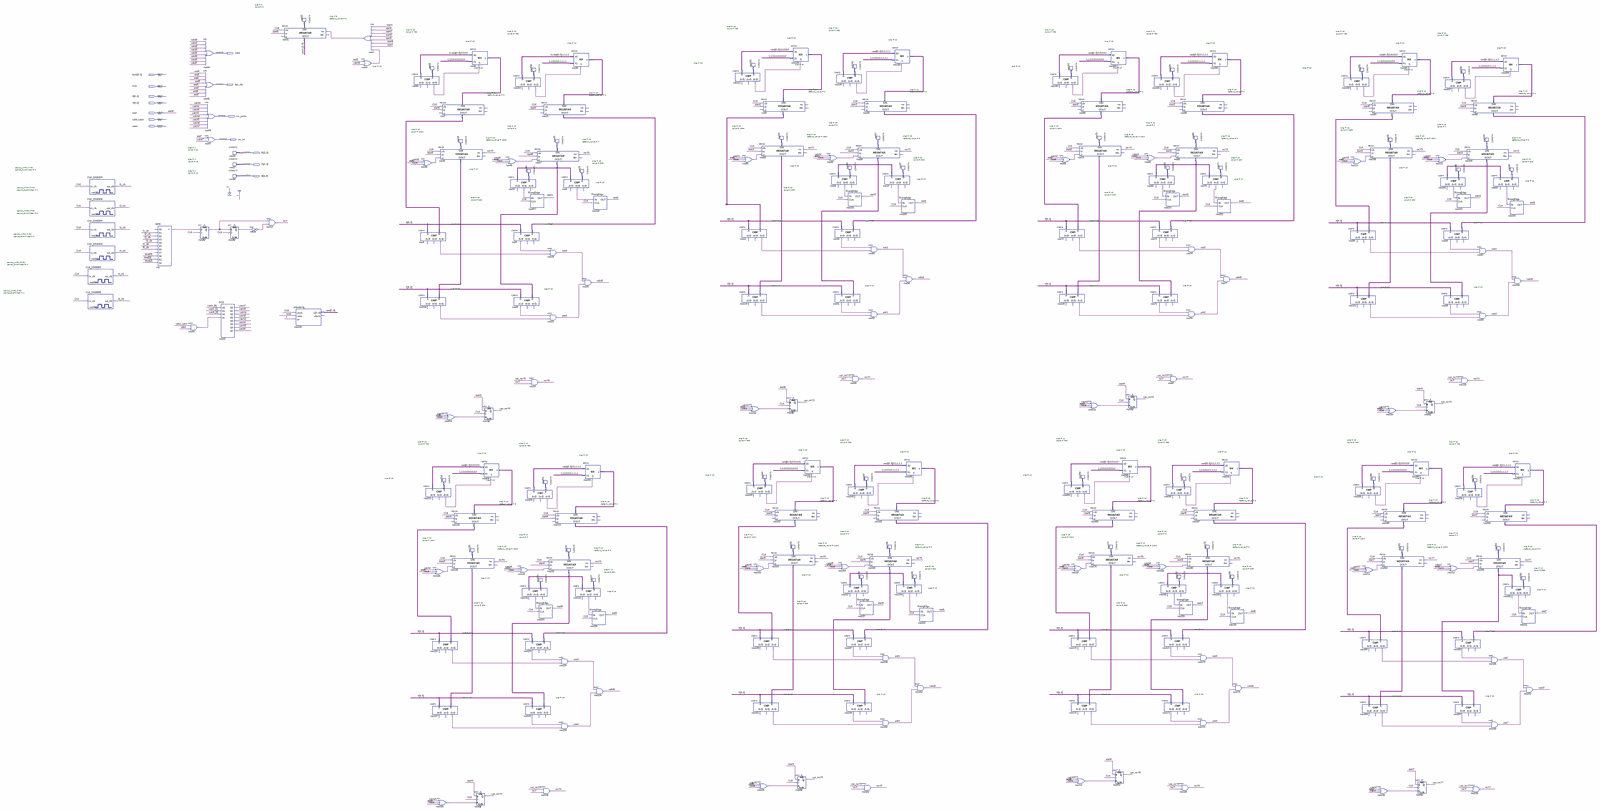
[diagram p0: schematic sheet, whole]
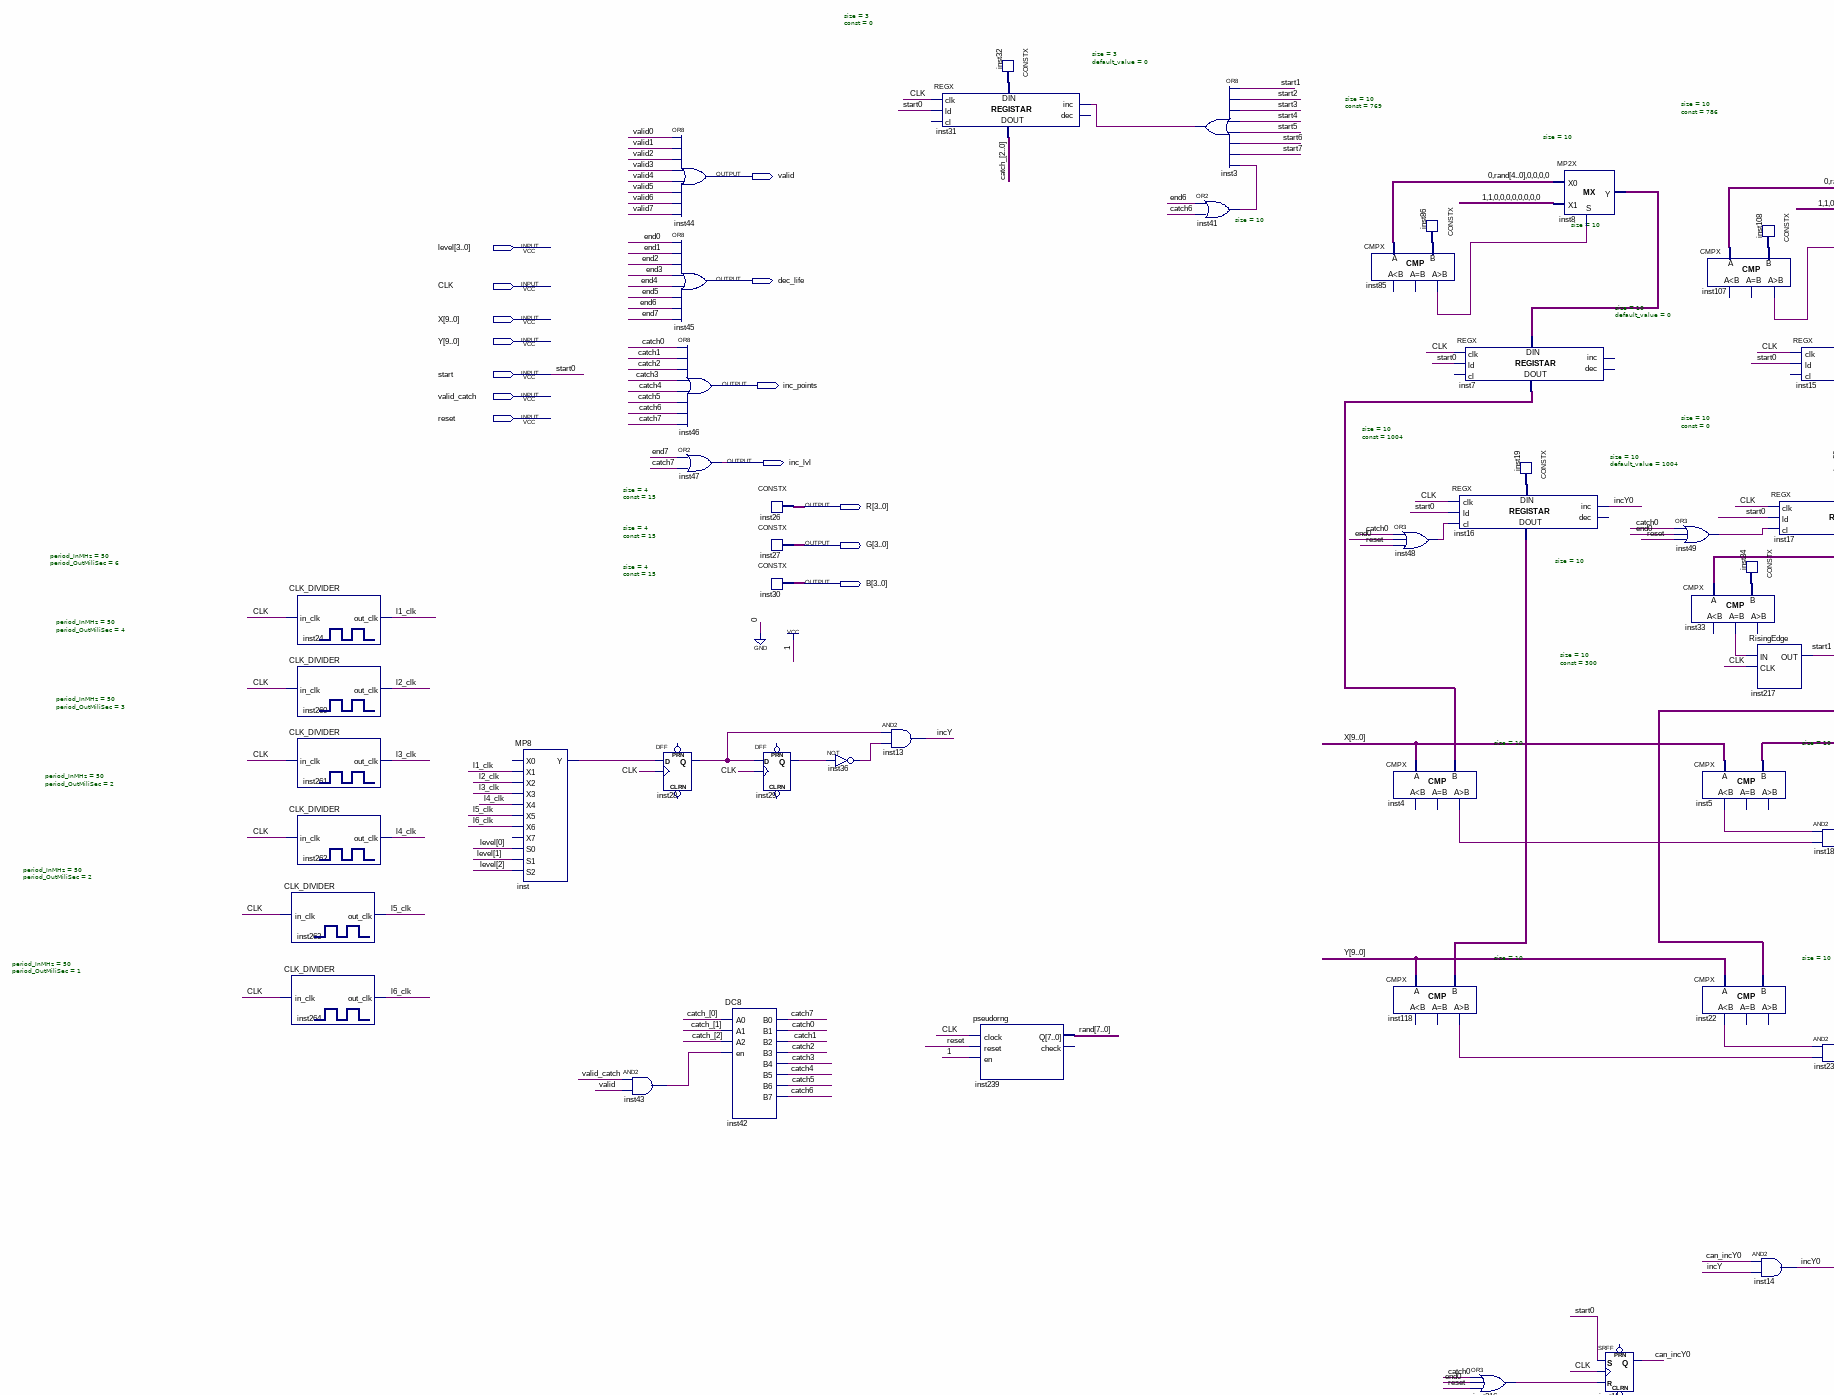
[diagram p1: schematic sheet, upper left part]
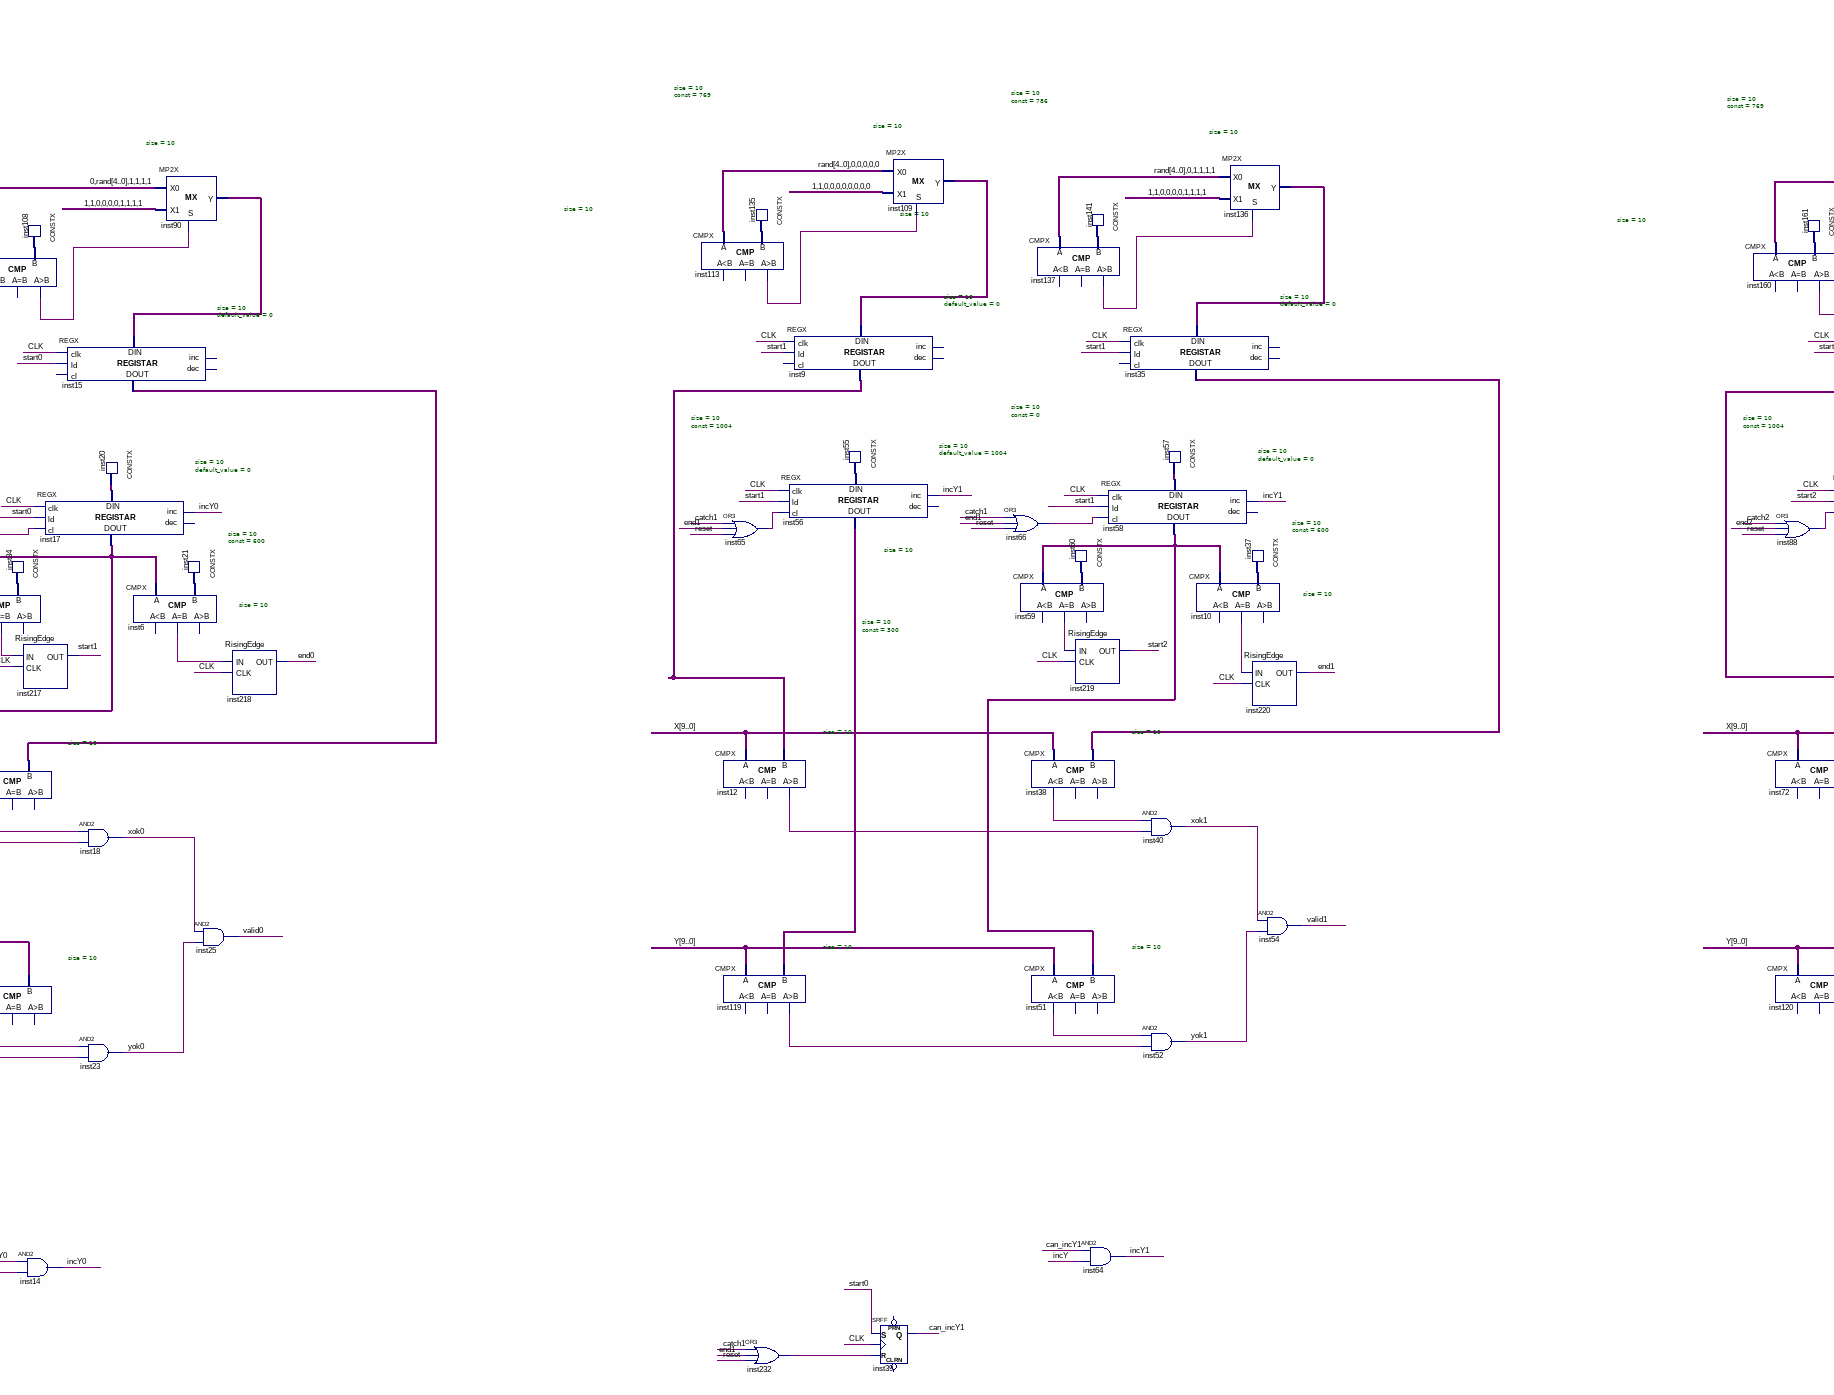
[diagram p2: schematic sheet, upper centre part]
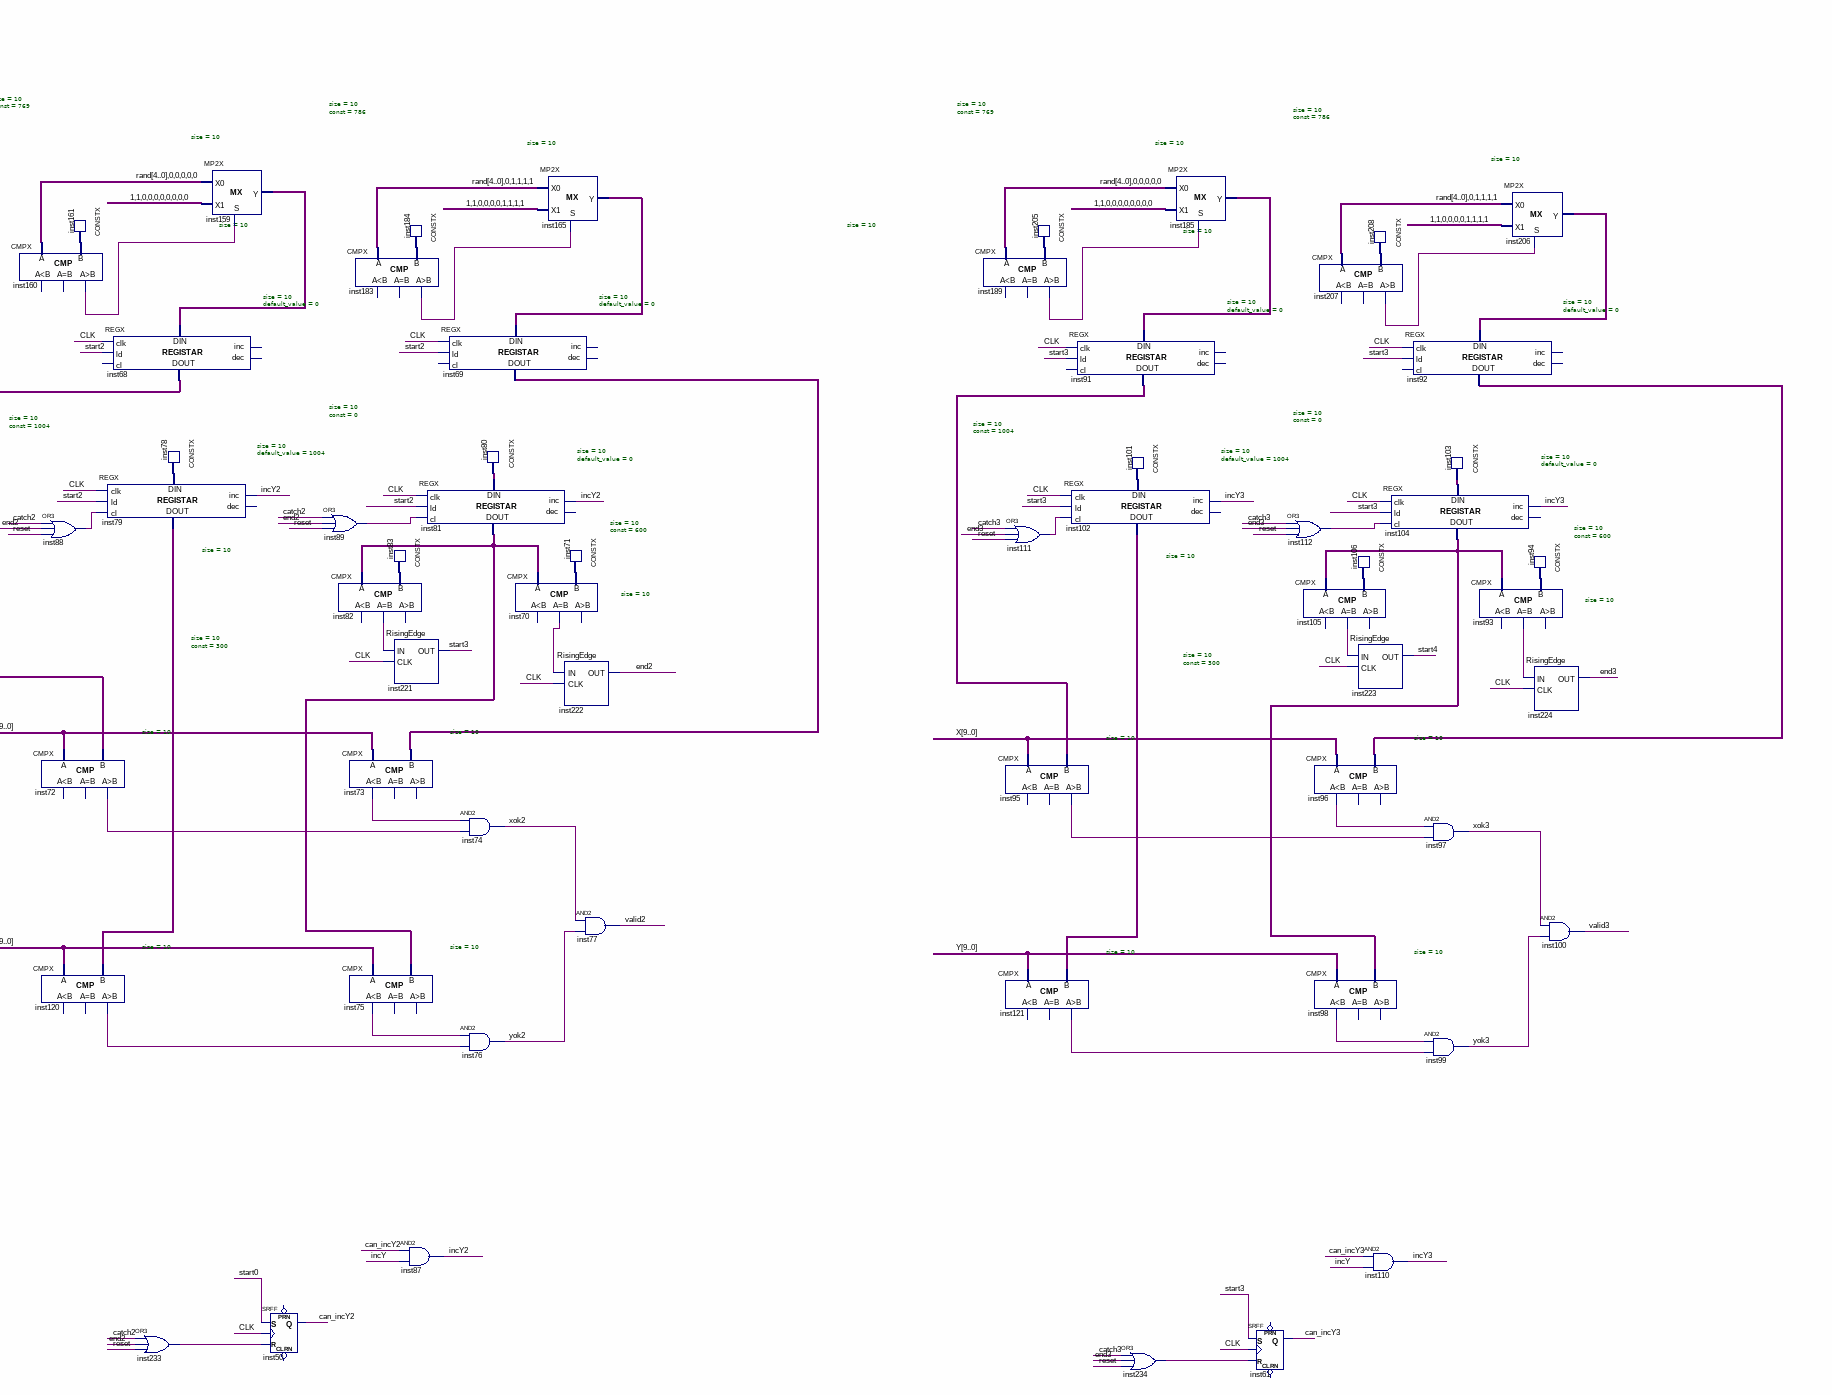
[diagram p3: schematic sheet, upper right part]
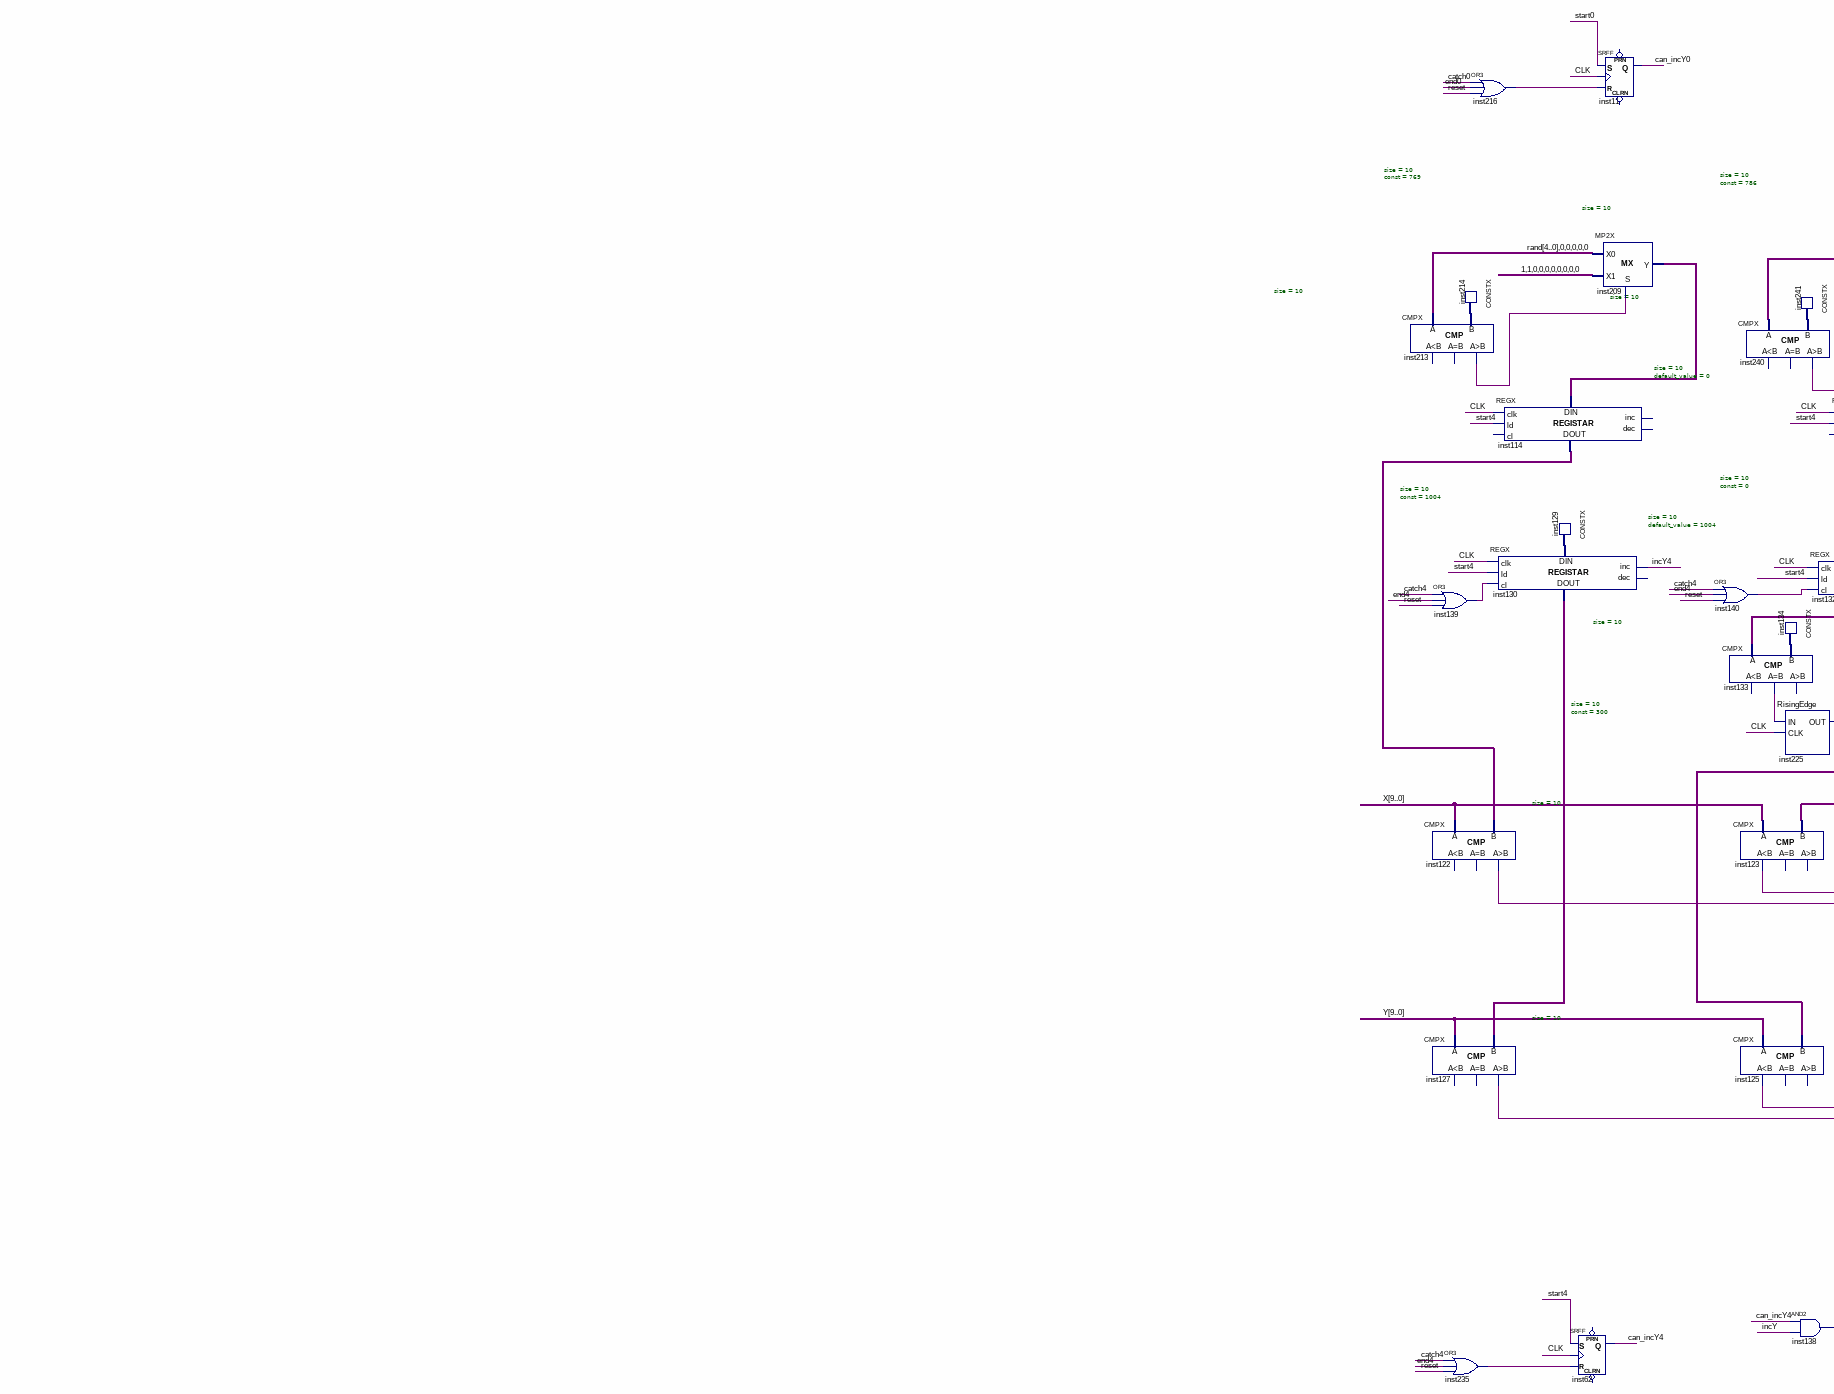
[diagram p4: schematic sheet, lower left part]
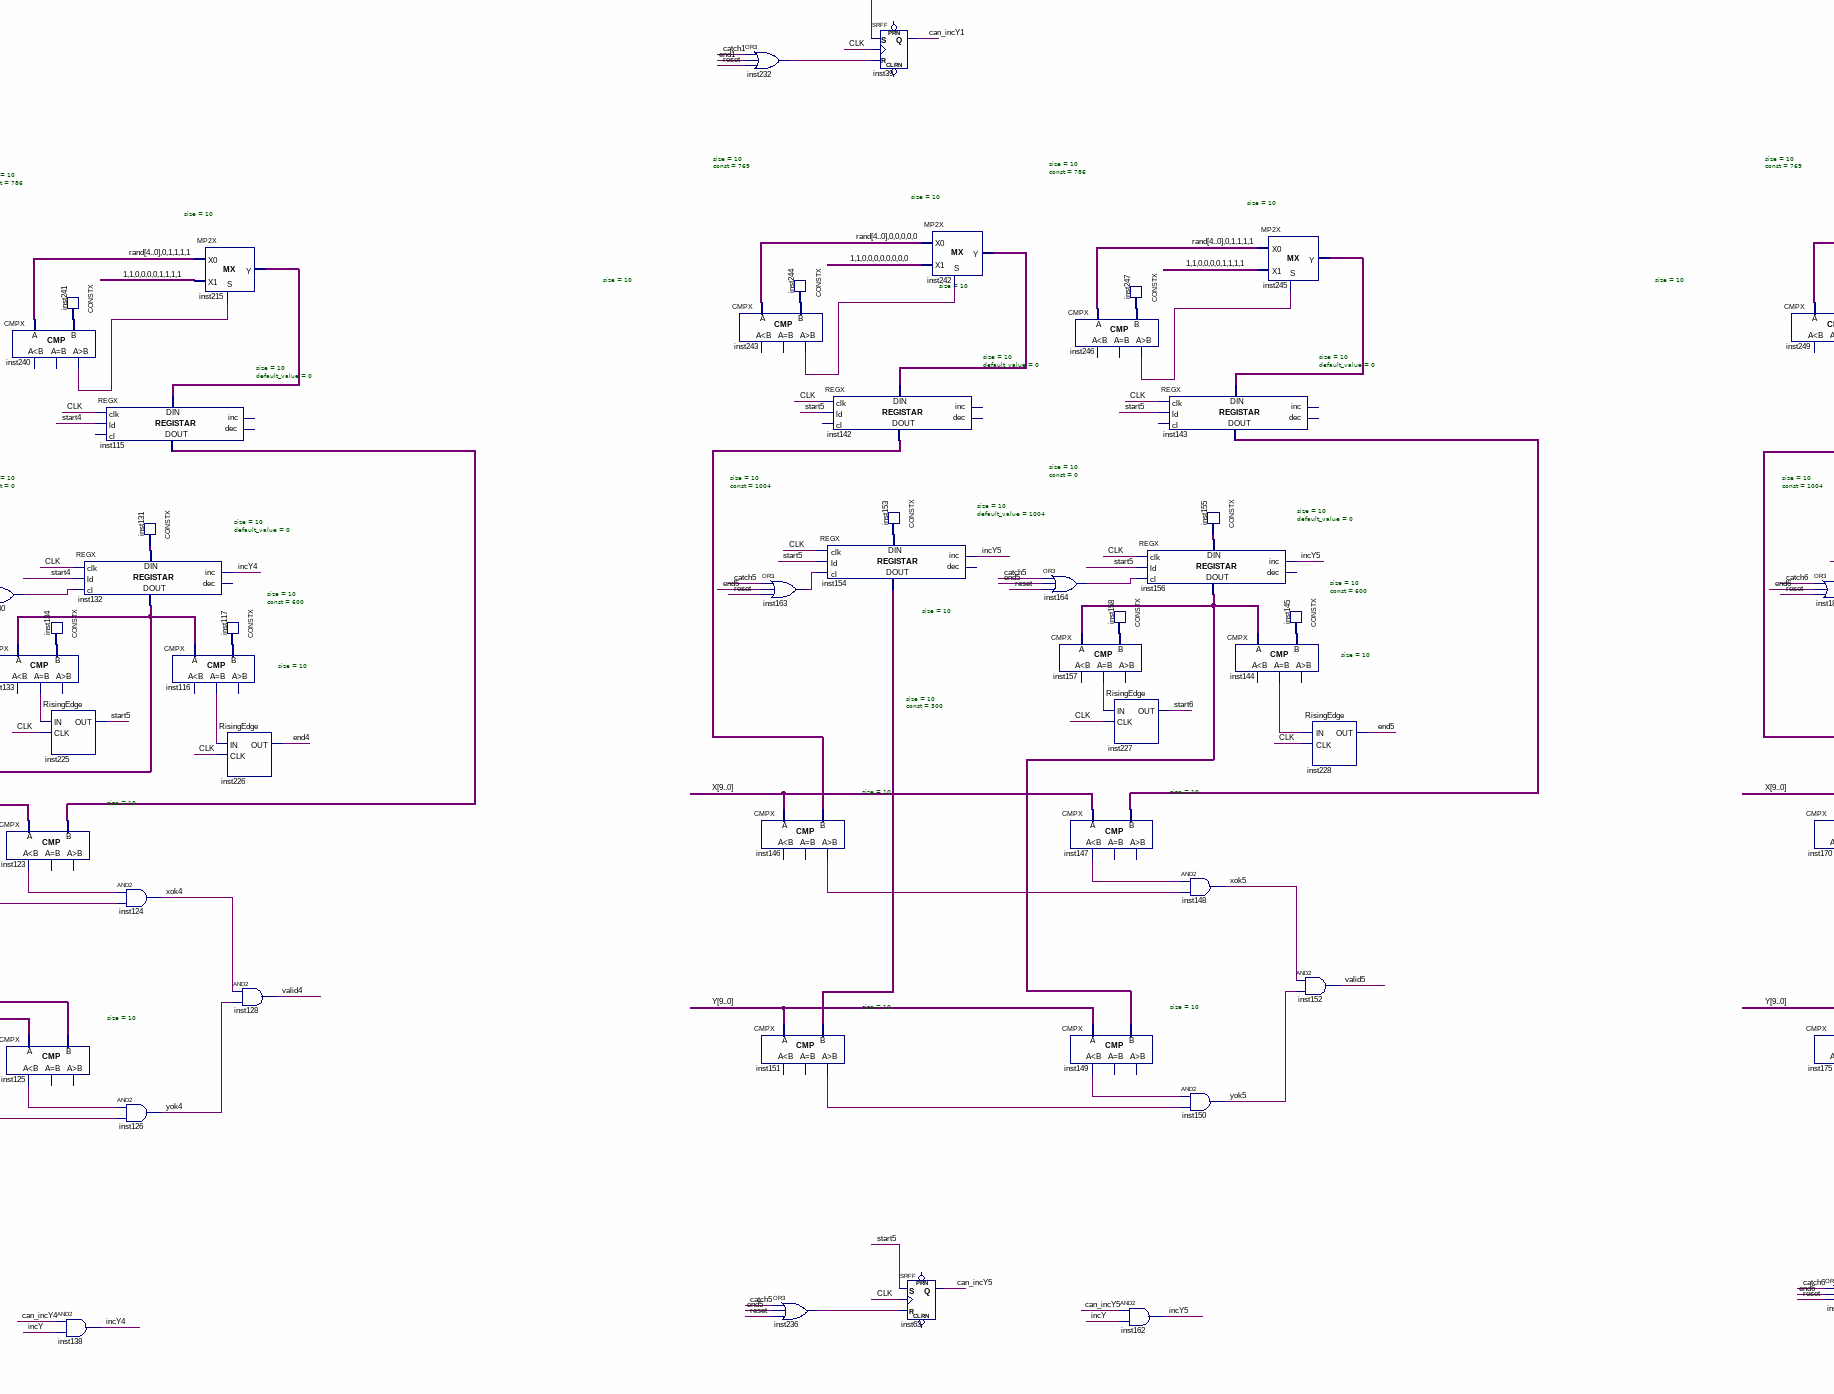
[diagram p5: schematic sheet, lower centre part]
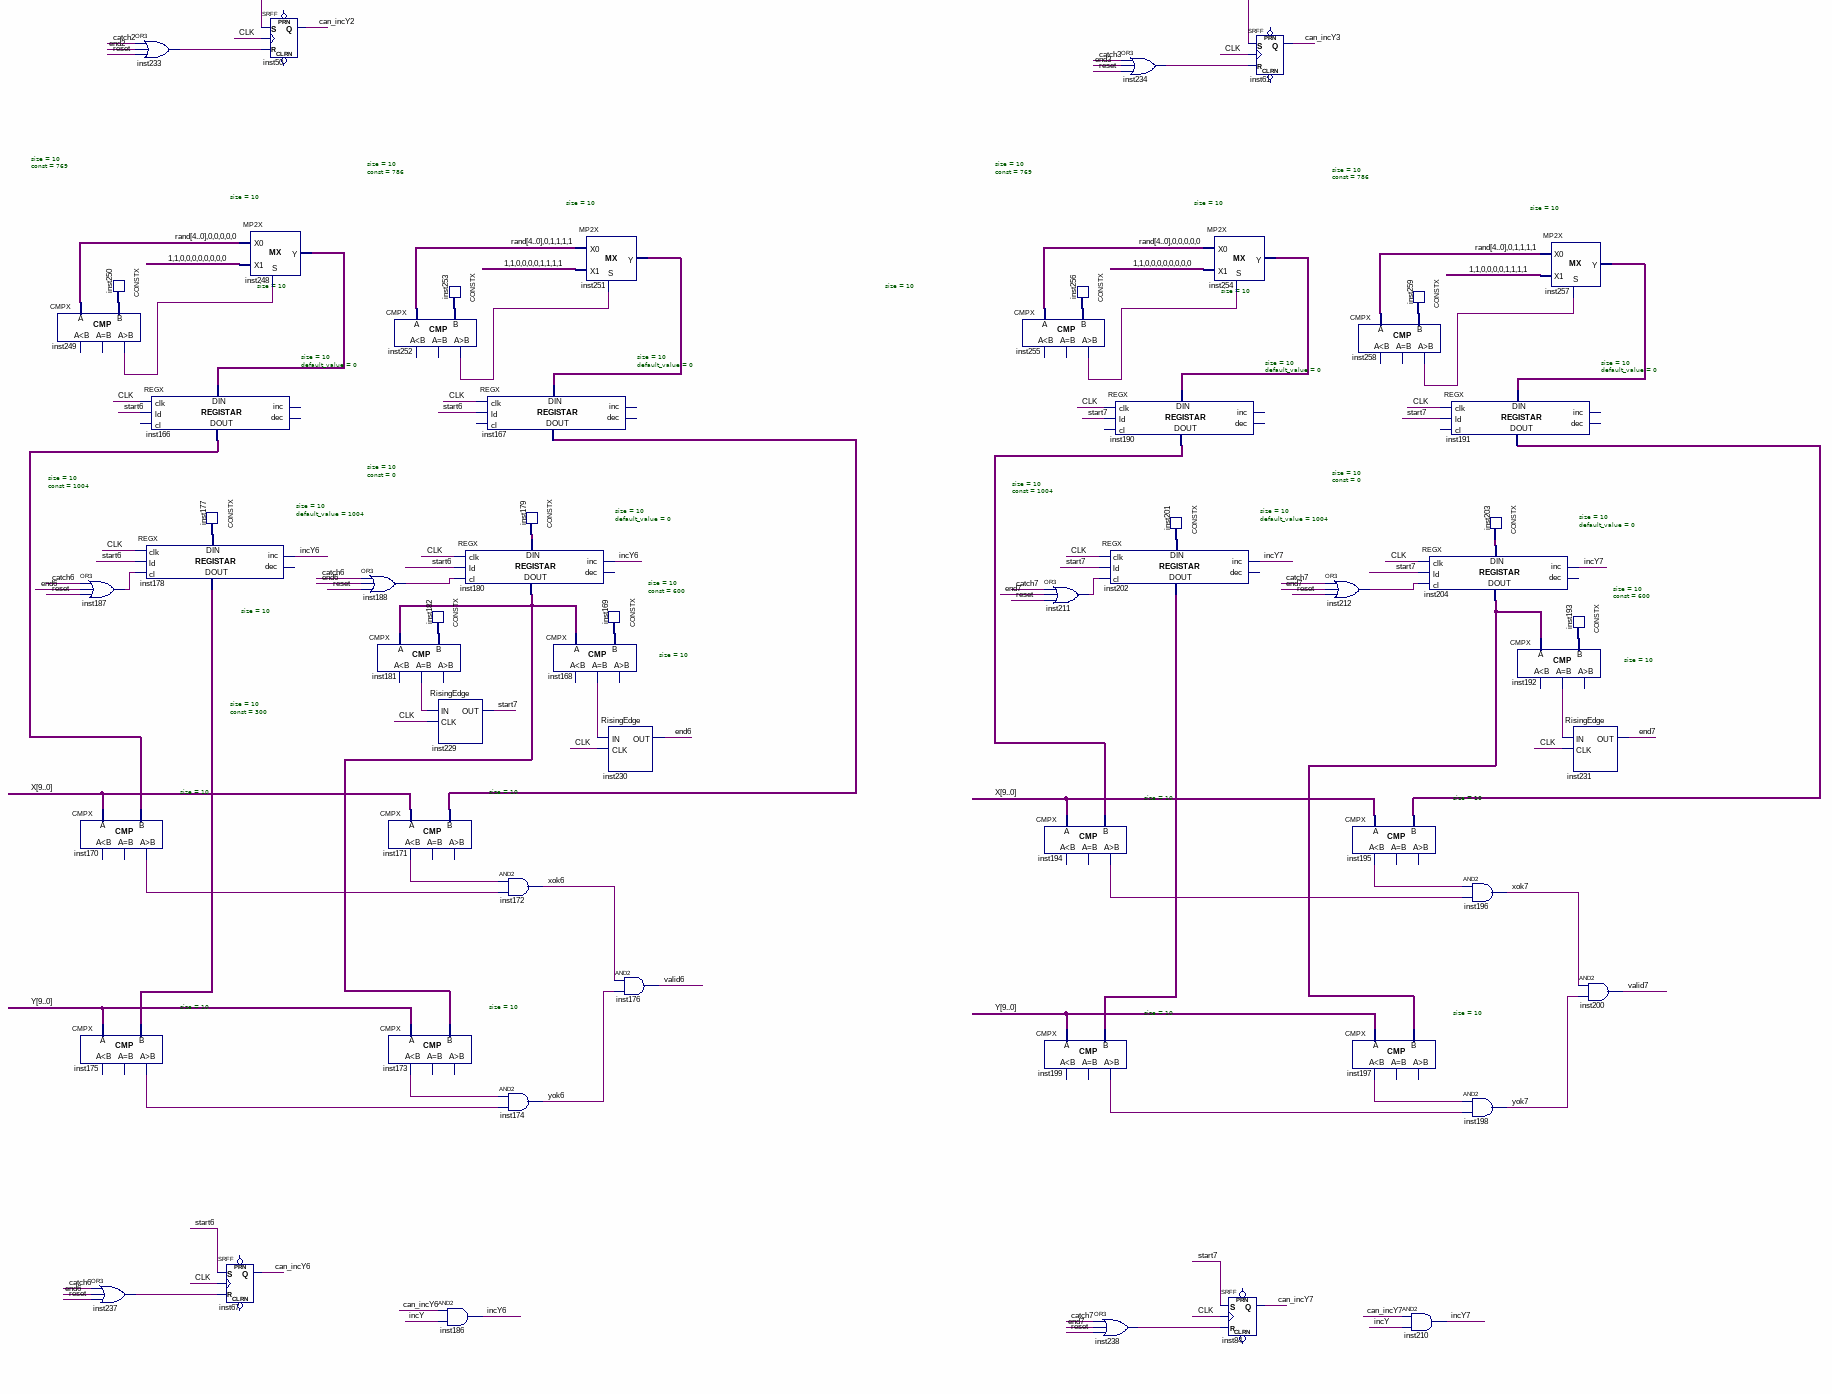
[diagram p6: schematic sheet, lower right part]
// Quartus schematic Layer2.bdf as structural Verilog: 262 symbols, 14 pins
module Layer2 (
  input  [3:0] level,
  input  CLK,
  input  [9:0] X,
  input  [9:0] Y,
  input  start,
  input  valid_catch,
  input  reset,
  output valid,
  output dec_life,
  output inc_points,
  output inc_lvl,
  output [3:0] R,
  output [3:0] G,
  output [3:0] B
);

  wire can_incY0, can_incY1, can_incY2, can_incY3, can_incY4, can_incY5, can_incY6, can_incY7, catch0,
       catch1, catch2, catch3, catch4, catch5, catch6, catch7, end0, end1, end2, end3, end4, end5, end6,
       end7, incY, incY0, incY1, incY2, incY3, incY4, incY5, incY6, incY7, inst3_out, inst4_gr, inst5_ls,
       inst6_eq, inst10_eq, inst12_gr, inst22_ls, inst28_q, inst29_q, inst33_eq, inst36_out, inst38_ls,
       inst41_out, inst43_out, inst48_out, inst49_out, inst51_ls, inst59_eq, inst65_out, inst66_out,
       inst70_eq, inst72_gr, inst73_ls, inst75_ls, inst82_eq, inst85_gr, inst88_out, inst89_out, inst93_eq,
       inst95_gr, inst96_ls, inst98_ls, inst105_eq, inst107_gr, inst111_out, inst112_out, inst113_gr,
       inst116_eq, inst118_gr, inst119_gr, inst120_gr, inst121_gr, inst122_gr, inst123_ls, inst125_ls,
       inst127_gr, inst133_eq, inst137_gr, inst139_out, inst140_out, inst144_eq, inst146_gr, inst147_ls,
       inst149_ls, inst151_gr, inst157_eq, inst160_gr, inst163_out, inst164_out, inst168_eq, inst170_gr,
       inst171_ls, inst173_ls, inst175_gr, inst181_eq, inst183_gr, inst187_out, inst188_out, inst189_gr,
       inst192_eq, inst194_gr, inst195_ls, inst197_ls, inst199_gr, inst207_gr, inst211_out, inst212_out,
       inst213_gr, inst216_out, inst232_out, inst233_out, inst234_out, inst235_out, inst236_out, inst237_out,
       inst238_out, inst240_gr, inst243_gr, inst246_gr, inst249_gr, inst252_gr, inst255_gr, inst258_gr,
       inst_y, l1_clk, l2_clk, l3_clk, l4_clk, l5_clk, l6_clk, start1, start2, start3, start4, start5,
       start6, start7, valid0, valid1, valid2, valid3, valid4, valid5, valid6, valid7, xok0, xok1, xok2,
       xok3, xok4, xok5, xok6, xok7, yok0, yok1, yok2, yok3, yok4, yok5, yok6, yok7;
  wire [2:0] catch_, inst32_data;
  wire [7:0] \rand ;
  wire [9:0] inst7_data_out, inst8_y, inst9_data_out, inst15_data_out, inst16_data_out, inst17_data_out,
       inst19_data, inst20_data, inst21_data, inst34_data, inst35_data_out, inst37_data, inst55_data,
       inst56_data_out, inst57_data, inst58_data_out, inst60_data, inst68_data_out, inst69_data_out,
       inst71_data, inst78_data, inst79_data_out, inst80_data, inst81_data_out, inst83_data, inst86_data,
       inst90_y, inst91_data_out, inst92_data_out, inst94_data, inst101_data, inst102_data_out, inst103_data,
       inst104_data_out, inst106_data, inst108_data, inst109_y, inst114_data_out, inst115_data_out,
       inst117_data, inst129_data, inst130_data_out, inst131_data, inst132_data_out, inst134_data,
       inst135_data, inst136_y, inst141_data, inst142_data_out, inst143_data_out, inst145_data, inst153_data,
       inst154_data_out, inst155_data, inst156_data_out, inst158_data, inst159_y, inst161_data, inst165_y,
       inst166_data_out, inst167_data_out, inst169_data, inst177_data, inst178_data_out, inst179_data,
       inst180_data_out, inst182_data, inst184_data, inst185_y, inst190_data_out, inst191_data_out,
       inst193_data, inst201_data, inst202_data_out, inst203_data, inst204_data_out, inst205_data, inst206_y,
       inst208_data, inst209_y, inst214_data, inst215_y, inst241_data, inst242_y, inst244_data, inst245_y,
       inst247_data, inst248_y, inst250_data, inst251_y, inst253_data, inst254_y, inst256_data, inst257_y,
       inst259_data;

  CLK_DIVIDER #(.period_InMHz(50), .period_OutMiliSec(6)) inst24 (.in_clk(CLK), .out_clk(l1_clk));
  CLK_DIVIDER #(.period_InMHz(50), .period_OutMiliSec(4)) inst260 (.in_clk(CLK), .out_clk(l2_clk));
  CLK_DIVIDER #(.period_InMHz(50), .period_OutMiliSec(3)) inst261 (.in_clk(CLK), .out_clk(l3_clk));
  CLK_DIVIDER #(.period_InMHz(50), .period_OutMiliSec(2)) inst262 (.in_clk(CLK), .out_clk(l4_clk));
  CLK_DIVIDER #(.period_InMHz(50), .period_OutMiliSec(2)) inst263 (.in_clk(CLK), .out_clk(l5_clk));
  CLK_DIVIDER #(.period_InMHz(50), .period_OutMiliSec(1)) inst264 (.in_clk(CLK), .out_clk(l6_clk));
  MP8 inst (
    .X1(l1_clk), .X2(l2_clk), .X3(l3_clk), .X4(l4_clk), .X5(l5_clk), .X6(l6_clk), .S0(level[0]),
    .S1(level[1]), .S2(level[2]), .Y(inst_y));  // open: X0, X7
  and inst43 (inst43_out, valid_catch, valid);
  or inst44 (valid, valid0, valid1, valid2, valid3, valid4, valid5, valid6, valid7);
  or inst45 (dec_life, end0, end1, end2, end3, end4, end5, end6, end7);
  or inst46 (inc_points, catch0, catch1, catch2, catch3, catch4, catch5, catch6, catch7);
  or inst47 (inc_lvl, end7, catch7);
  DFF inst28 (.CLK(CLK), .D(inst_y), .Q(inst28_q));  // open: CLRN, PRN
  DC8 inst42 (
    .A0(catch_[0]), .A1(catch_[1]), .A2(catch_[2]), .en(inst43_out), .B0(catch7), .B1(catch0), .B2(catch1),
    .B3(catch2), .B4(catch3), .B5(catch4), .B6(catch5), .B7(catch6));
  CONSTX #(.size(4), .\const (15)) inst26 (.data(R));
  CONSTX #(.size(4), .\const (15)) inst27 (.data(G));
  CONSTX #(.size(4), .\const (15)) inst30 (.data(B));
  DFF inst29 (.CLK(CLK), .D(inst28_q), .Q(inst29_q));  // open: CLRN, PRN
  not inst36 (inst36_out, inst29_q);
  and inst13 (incY, inst28_q, inst36_out);
  REGX #(.size(3), .default_value(0)) inst31 (
    .clk(CLK), .ld(start), .inc(inst3_out), .data_in(inst32_data), .data_out(catch_));  // open: cl, dec
  CONSTX #(.size(3), .\const (0)) inst32 (.data(inst32_data));
  pseudorng inst239 (.clock(CLK), .reset(reset), .en(1'b1), .Q(\rand ));  // open: check
  or inst3 (inst3_out, start1, start2, start3, start4, start5, start6, start7, inst41_out);
  or inst41 (inst41_out, end6, catch6);
  CMPX #(.size(10)) inst85 (.A({1'b0, \rand [4:0], 4'b0000}), .B(inst86_data), .gr(inst85_gr));  // open: ls, eq
  or inst48 (inst48_out, catch0, end0, reset);
  CMPX #(.size(10)) inst4 (.A(X), .B(inst7_data_out), .gr(inst4_gr));  // open: ls, eq
  CMPX #(.size(10)) inst118 (.A(Y), .B(inst16_data_out), .gr(inst118_gr));  // open: ls, eq
  CMPX #(.size(10)) inst213 (.A({\rand [4:0], {5{1'b0}}}), .B(inst214_data), .gr(inst213_gr));  // open: ls, eq
  CONSTX #(.size(10), .\const (769)) inst86 (.data(inst86_data));
  or inst139 (inst139_out, catch4, end4, reset);
  CMPX #(.size(10)) inst122 (.A(X), .B(inst114_data_out), .gr(inst122_gr));  // open: ls, eq
  CMPX #(.size(10)) inst127 (.A(Y), .B(inst130_data_out), .gr(inst127_gr));  // open: ls, eq
  or inst235 (inst235_out, catch4, end4, reset);
  REGX #(.size(10), .default_value(0)) inst7 (
    .clk(CLK), .ld(start), .data_in(inst8_y), .data_out(inst7_data_out));  // open: cl, inc, dec
  REGX #(.size(10), .default_value(1004)) inst16 (
    .clk(CLK), .ld(start), .cl(inst48_out), .inc(incY0), .data_in(inst19_data), .data_out(inst16_data_out));  // open: dec
  or inst216 (inst216_out, catch0, end0, reset);
  CONSTX #(.size(10), .\const (769)) inst214 (.data(inst214_data));
  REGX #(.size(10), .default_value(1004)) inst130 (
    .clk(CLK), .ld(start4), .cl(inst139_out), .inc(incY4), .data_in(inst129_data), .data_out(inst130_data_out));  // open: dec
  CONSTX #(.size(10), .\const (1004)) inst19 (.data(inst19_data));
  REGX #(.size(10), .default_value(0)) inst114 (
    .clk(CLK), .ld(start4), .data_in(inst209_y), .data_out(inst114_data_out));  // open: cl, inc, dec
  MP2X #(.size(10)) inst8 (.S(inst85_gr), .X0({1'b0, \rand [4:0], 4'b0000}), .X1(10'b1100000000), .Y(inst8_y));
  CONSTX #(.size(10), .\const (1004)) inst129 (.data(inst129_data));
  SRFF inst62 (.S(start4), .R(inst235_out), .CLK(CLK), .Q(can_incY4));  // open: PRN, CLRN
  SRFF inst11 (.S(start), .R(inst216_out), .CLK(CLK), .Q(can_incY0));  // open: PRN, CLRN
  MP2X #(.size(10)) inst209 (.S(inst213_gr), .X0({\rand [4:0], {5{1'b0}}}), .X1(10'b1100000000), .Y(inst209_y));
  CMPX #(.size(10)) inst107 (.A({1'b0, \rand [4:0], 4'b1111}), .B(inst108_data), .gr(inst107_gr));  // open: ls, eq
  or inst49 (inst49_out, catch0, end0, reset);
  CMPX #(.size(10)) inst33 (.A(inst17_data_out), .B(inst34_data), .eq(inst33_eq));  // open: ls, gr
  CMPX #(.size(10)) inst5 (.A(X), .B(inst15_data_out), .ls(inst5_ls));  // open: eq, gr
  CMPX #(.size(10)) inst22 (.A(Y), .B(inst17_data_out), .ls(inst22_ls));  // open: eq, gr
  CONSTX #(.size(10), .\const (786)) inst108 (.data(inst108_data));
  CONSTX #(.size(10), .\const (300)) inst34 (.data(inst34_data));
  RisingEdge inst217 (.IN(inst33_eq), .CLK(CLK), .OUT(start1));
  and inst14 (incY0, can_incY0, incY);
  CMPX #(.size(10)) inst240 (.A({\rand [4:0], 5'b01111}), .B(inst241_data), .gr(inst240_gr));  // open: ls, eq
  or inst140 (inst140_out, catch4, end4, reset);
  CMPX #(.size(10)) inst133 (.A(inst132_data_out), .B(inst134_data), .eq(inst133_eq));  // open: ls, gr
  CMPX #(.size(10)) inst123 (.A(X), .B(inst115_data_out), .ls(inst123_ls));  // open: eq, gr
  CMPX #(.size(10)) inst125 (.A(Y), .B(inst132_data_out), .ls(inst125_ls));  // open: eq, gr
  REGX #(.size(10), .default_value(0)) inst15 (
    .clk(CLK), .ld(start), .data_in(inst90_y), .data_out(inst15_data_out));  // open: cl, inc, dec
  REGX #(.size(10), .default_value(0)) inst17 (
    .clk(CLK), .ld(start), .cl(inst49_out), .inc(incY0), .data_in(inst20_data), .data_out(inst17_data_out));  // open: dec
  CONSTX #(.size(10), .\const (786)) inst241 (.data(inst241_data));
  CONSTX #(.size(10), .\const (300)) inst134 (.data(inst134_data));
  RisingEdge inst225 (.IN(inst133_eq), .CLK(CLK), .OUT(start5));
  and inst138 (incY4, can_incY4, incY);
  CONSTX #(.size(10), .\const (0)) inst20 (.data(inst20_data));
  and inst18 (xok0, inst5_ls, inst4_gr);
  and inst23 (yok0, inst22_ls, inst118_gr);
  REGX #(.size(10), .default_value(0)) inst115 (
    .clk(CLK), .ld(start4), .data_in(inst215_y), .data_out(inst115_data_out));  // open: cl, inc, dec
  REGX #(.size(10), .default_value(0)) inst132 (
    .clk(CLK), .ld(start4), .cl(inst140_out), .inc(incY4), .data_in(inst131_data), .data_out(inst132_data_out));  // open: dec
  CMPX #(.size(10)) inst6 (.A(inst17_data_out), .B(inst21_data), .eq(inst6_eq));  // open: ls, gr
  CONSTX #(.size(10), .\const (0)) inst131 (.data(inst131_data));
  and inst124 (xok4, inst123_ls, inst122_gr);
  and inst126 (yok4, inst125_ls, inst127_gr);
  MP2X #(.size(10)) inst90 (.S(inst107_gr), .X0({1'b0, \rand [4:0], 4'b1111}), .X1(10'b1100001111), .Y(inst90_y));
  CONSTX #(.size(10), .\const (600)) inst21 (.data(inst21_data));
  and inst25 (valid0, xok0, yok0);
  MP2X #(.size(10)) inst215 (.S(inst240_gr), .X0({\rand [4:0], 5'b01111}), .X1(10'b1100001111), .Y(inst215_y));
  CMPX #(.size(10)) inst116 (.A(inst132_data_out), .B(inst117_data), .eq(inst116_eq));  // open: ls, gr
  RisingEdge inst218 (.IN(inst6_eq), .CLK(CLK), .OUT(end0));
  CONSTX #(.size(10), .\const (600)) inst117 (.data(inst117_data));
  RisingEdge inst226 (.IN(inst116_eq), .CLK(CLK), .OUT(end4));
  and inst128 (valid4, xok4, yok4);
  CMPX #(.size(10)) inst113 (.A({\rand [4:0], {5{1'b0}}}), .B(inst135_data), .gr(inst113_gr));  // open: ls, eq
  or inst65 (inst65_out, catch1, end1, reset);
  CMPX #(.size(10)) inst12 (.A(X), .B(inst9_data_out), .gr(inst12_gr));  // open: ls, eq
  CMPX #(.size(10)) inst119 (.A(Y), .B(inst56_data_out), .gr(inst119_gr));  // open: ls, eq
  CONSTX #(.size(10), .\const (769)) inst135 (.data(inst135_data));
  or inst232 (inst232_out, catch1, end1, reset);
  CMPX #(.size(10)) inst243 (.A({\rand [4:0], {5{1'b0}}}), .B(inst244_data), .gr(inst243_gr));  // open: ls, eq
  or inst163 (inst163_out, catch5, end5, reset);
  CMPX #(.size(10)) inst146 (.A(X), .B(inst142_data_out), .gr(inst146_gr));  // open: ls, eq
  CMPX #(.size(10)) inst151 (.A(Y), .B(inst154_data_out), .gr(inst151_gr));  // open: ls, eq
  REGX #(.size(10), .default_value(0)) inst9 (
    .clk(CLK), .ld(start1), .data_in(inst109_y), .data_out(inst9_data_out));  // open: cl, inc, dec
  REGX #(.size(10), .default_value(1004)) inst56 (
    .clk(CLK), .ld(start1), .cl(inst65_out), .inc(incY1), .data_in(inst55_data), .data_out(inst56_data_out));  // open: dec
  CONSTX #(.size(10), .\const (769)) inst244 (.data(inst244_data));
  or inst236 (inst236_out, catch5, end5, reset);
  CONSTX #(.size(10), .\const (1004)) inst55 (.data(inst55_data));
  REGX #(.size(10), .default_value(0)) inst142 (
    .clk(CLK), .ld(start5), .data_in(inst242_y), .data_out(inst142_data_out));  // open: cl, inc, dec
  REGX #(.size(10), .default_value(1004)) inst154 (
    .clk(CLK), .ld(start5), .cl(inst163_out), .inc(incY5), .data_in(inst153_data), .data_out(inst154_data_out));  // open: dec
  MP2X #(.size(10)) inst109 (.S(inst113_gr), .X0({\rand [4:0], {5{1'b0}}}), .X1(10'b1100000000), .Y(inst109_y));
  SRFF inst39 (.S(start), .R(inst232_out), .CLK(CLK), .Q(can_incY1));  // open: PRN, CLRN
  CONSTX #(.size(10), .\const (1004)) inst153 (.data(inst153_data));
  SRFF inst63 (.S(start5), .R(inst236_out), .CLK(CLK), .Q(can_incY5));  // open: PRN, CLRN
  MP2X #(.size(10)) inst242 (.S(inst243_gr), .X0({\rand [4:0], {5{1'b0}}}), .X1(10'b1100000000), .Y(inst242_y));
  CMPX #(.size(10)) inst137 (.A({\rand [4:0], 5'b01111}), .B(inst141_data), .gr(inst137_gr));  // open: ls, eq
  or inst66 (inst66_out, catch1, end1, reset);
  CMPX #(.size(10)) inst59 (.A(inst58_data_out), .B(inst60_data), .eq(inst59_eq));  // open: ls, gr
  CMPX #(.size(10)) inst38 (.A(X), .B(inst35_data_out), .ls(inst38_ls));  // open: eq, gr
  CMPX #(.size(10)) inst51 (.A(Y), .B(inst58_data_out), .ls(inst51_ls));  // open: eq, gr
  CONSTX #(.size(10), .\const (300)) inst60 (.data(inst60_data));
  RisingEdge inst219 (.IN(inst59_eq), .CLK(CLK), .OUT(start2));
  CMPX #(.size(10)) inst246 (.A({\rand [4:0], 5'b01111}), .B(inst247_data), .gr(inst246_gr));  // open: ls, eq
  or inst164 (inst164_out, catch5, end5, reset);
  CMPX #(.size(10)) inst157 (.A(inst156_data_out), .B(inst158_data), .eq(inst157_eq));  // open: ls, gr
  CMPX #(.size(10)) inst147 (.A(X), .B(inst143_data_out), .ls(inst147_ls));  // open: eq, gr
  CMPX #(.size(10)) inst149 (.A(Y), .B(inst156_data_out), .ls(inst149_ls));  // open: eq, gr
  CONSTX #(.size(10), .\const (786)) inst141 (.data(inst141_data));
  REGX #(.size(10), .default_value(0)) inst35 (
    .clk(CLK), .ld(start1), .data_in(inst136_y), .data_out(inst35_data_out));  // open: cl, inc, dec
  REGX #(.size(10), .default_value(0)) inst58 (
    .clk(CLK), .ld(start1), .cl(inst66_out), .inc(incY1), .data_in(inst57_data), .data_out(inst58_data_out));  // open: dec
  and inst64 (incY1, can_incY1, incY);
  CONSTX #(.size(10), .\const (786)) inst247 (.data(inst247_data));
  CONSTX #(.size(10), .\const (300)) inst158 (.data(inst158_data));
  RisingEdge inst227 (.IN(inst157_eq), .CLK(CLK), .OUT(start6));
  and inst162 (incY5, can_incY5, incY);
  CONSTX #(.size(10), .\const (0)) inst57 (.data(inst57_data));
  and inst40 (xok1, inst38_ls, inst12_gr);
  and inst52 (yok1, inst51_ls, inst119_gr);
  REGX #(.size(10), .default_value(0)) inst143 (
    .clk(CLK), .ld(start5), .data_in(inst245_y), .data_out(inst143_data_out));  // open: cl, inc, dec
  REGX #(.size(10), .default_value(0)) inst156 (
    .clk(CLK), .ld(start5), .cl(inst164_out), .inc(incY5), .data_in(inst155_data), .data_out(inst156_data_out));  // open: dec
  CMPX #(.size(10)) inst10 (.A(inst58_data_out), .B(inst37_data), .eq(inst10_eq));  // open: ls, gr
  CONSTX #(.size(10), .\const (0)) inst155 (.data(inst155_data));
  and inst148 (xok5, inst147_ls, inst146_gr);
  and inst150 (yok5, inst149_ls, inst151_gr);
  MP2X #(.size(10)) inst136 (.S(inst137_gr), .X0({\rand [4:0], 5'b01111}), .X1(10'b1100001111), .Y(inst136_y));
  CONSTX #(.size(10), .\const (600)) inst37 (.data(inst37_data));
  RisingEdge inst220 (.IN(inst10_eq), .CLK(CLK), .OUT(end1));
  CMPX #(.size(10)) inst144 (.A(inst156_data_out), .B(inst145_data), .eq(inst144_eq));  // open: ls, gr
  and inst54 (valid1, xok1, yok1);
  MP2X #(.size(10)) inst245 (.S(inst246_gr), .X0({\rand [4:0], 5'b01111}), .X1(10'b1100001111), .Y(inst245_y));
  CONSTX #(.size(10), .\const (600)) inst145 (.data(inst145_data));
  and inst152 (valid5, xok5, yok5);
  RisingEdge inst228 (.IN(inst144_eq), .CLK(CLK), .OUT(end5));
  CMPX #(.size(10)) inst160 (.A({\rand [4:0], {5{1'b0}}}), .B(inst161_data), .gr(inst160_gr));  // open: ls, eq
  or inst88 (inst88_out, catch2, end2, reset);
  CMPX #(.size(10)) inst72 (.A(X), .B(inst68_data_out), .gr(inst72_gr));  // open: ls, eq
  CMPX #(.size(10)) inst120 (.A(Y), .B(inst79_data_out), .gr(inst120_gr));  // open: ls, eq
  CMPX #(.size(10)) inst249 (.A({\rand [4:0], {5{1'b0}}}), .B(inst250_data), .gr(inst249_gr));  // open: ls, eq
  CONSTX #(.size(10), .\const (769)) inst161 (.data(inst161_data));
  or inst187 (inst187_out, catch6, end6, reset);
  CMPX #(.size(10)) inst170 (.A(X), .B(inst166_data_out), .gr(inst170_gr));  // open: ls, eq
  CMPX #(.size(10)) inst175 (.A(Y), .B(inst178_data_out), .gr(inst175_gr));  // open: ls, eq
  or inst237 (inst237_out, catch6, end6, reset);
  REGX #(.size(10), .default_value(0)) inst68 (
    .clk(CLK), .ld(start2), .data_in(inst159_y), .data_out(inst68_data_out));  // open: cl, inc, dec
  REGX #(.size(10), .default_value(1004)) inst79 (
    .clk(CLK), .ld(start2), .cl(inst88_out), .inc(incY2), .data_in(inst78_data), .data_out(inst79_data_out));  // open: dec
  or inst233 (inst233_out, catch2, end2, reset);
  CONSTX #(.size(10), .\const (769)) inst250 (.data(inst250_data));
  REGX #(.size(10), .default_value(1004)) inst178 (
    .clk(CLK), .ld(start6), .cl(inst187_out), .inc(incY6), .data_in(inst177_data), .data_out(inst178_data_out));  // open: dec
  CONSTX #(.size(10), .\const (1004)) inst78 (.data(inst78_data));
  REGX #(.size(10), .default_value(0)) inst166 (
    .clk(CLK), .ld(start6), .data_in(inst248_y), .data_out(inst166_data_out));  // open: cl, inc, dec
  MP2X #(.size(10)) inst159 (.S(inst160_gr), .X0({\rand [4:0], {5{1'b0}}}), .X1(10'b1100000000), .Y(inst159_y));
  CONSTX #(.size(10), .\const (1004)) inst177 (.data(inst177_data));
  SRFF inst67 (.S(start6), .R(inst237_out), .CLK(CLK), .Q(can_incY6));  // open: PRN, CLRN
  SRFF inst50 (.S(start), .R(inst233_out), .CLK(CLK), .Q(can_incY2));  // open: PRN, CLRN
  MP2X #(.size(10)) inst248 (.S(inst249_gr), .X0({\rand [4:0], {5{1'b0}}}), .X1(10'b1100000000), .Y(inst248_y));
  CMPX #(.size(10)) inst183 (.A({\rand [4:0], 5'b01111}), .B(inst184_data), .gr(inst183_gr));  // open: ls, eq
  or inst89 (inst89_out, catch2, end2, reset);
  CMPX #(.size(10)) inst82 (.A(inst81_data_out), .B(inst83_data), .eq(inst82_eq));  // open: ls, gr
  CMPX #(.size(10)) inst73 (.A(X), .B(inst69_data_out), .ls(inst73_ls));  // open: eq, gr
  CMPX #(.size(10)) inst75 (.A(Y), .B(inst81_data_out), .ls(inst75_ls));  // open: eq, gr
  CONSTX #(.size(10), .\const (786)) inst184 (.data(inst184_data));
  CONSTX #(.size(10), .\const (300)) inst83 (.data(inst83_data));
  RisingEdge inst221 (.IN(inst82_eq), .CLK(CLK), .OUT(start3));
  and inst87 (incY2, can_incY2, incY);
  CMPX #(.size(10)) inst252 (.A({\rand [4:0], 5'b01111}), .B(inst253_data), .gr(inst252_gr));  // open: ls, eq
  or inst188 (inst188_out, catch6, end6, reset);
  CMPX #(.size(10)) inst181 (.A(inst180_data_out), .B(inst182_data), .eq(inst181_eq));  // open: ls, gr
  CMPX #(.size(10)) inst171 (.A(X), .B(inst167_data_out), .ls(inst171_ls));  // open: eq, gr
  CMPX #(.size(10)) inst173 (.A(Y), .B(inst180_data_out), .ls(inst173_ls));  // open: eq, gr
  REGX #(.size(10), .default_value(0)) inst69 (
    .clk(CLK), .ld(start2), .data_in(inst165_y), .data_out(inst69_data_out));  // open: cl, inc, dec
  REGX #(.size(10), .default_value(0)) inst81 (
    .clk(CLK), .ld(start2), .cl(inst89_out), .inc(incY2), .data_in(inst80_data), .data_out(inst81_data_out));  // open: dec
  CONSTX #(.size(10), .\const (786)) inst253 (.data(inst253_data));
  CONSTX #(.size(10), .\const (300)) inst182 (.data(inst182_data));
  RisingEdge inst229 (.IN(inst181_eq), .CLK(CLK), .OUT(start7));
  and inst186 (incY6, can_incY6, incY);
  CONSTX #(.size(10), .\const (0)) inst80 (.data(inst80_data));
  and inst74 (xok2, inst73_ls, inst72_gr);
  and inst76 (yok2, inst75_ls, inst120_gr);
  REGX #(.size(10), .default_value(0)) inst167 (
    .clk(CLK), .ld(start6), .data_in(inst251_y), .data_out(inst167_data_out));  // open: cl, inc, dec
  REGX #(.size(10), .default_value(0)) inst180 (
    .clk(CLK), .ld(start6), .cl(inst188_out), .inc(incY6), .data_in(inst179_data), .data_out(inst180_data_out));  // open: dec
  CMPX #(.size(10)) inst70 (.A(inst81_data_out), .B(inst71_data), .eq(inst70_eq));  // open: ls, gr
  CONSTX #(.size(10), .\const (0)) inst179 (.data(inst179_data));
  and inst172 (xok6, inst171_ls, inst170_gr);
  and inst174 (yok6, inst173_ls, inst175_gr);
  MP2X #(.size(10)) inst165 (.S(inst183_gr), .X0({\rand [4:0], 5'b01111}), .X1(10'b1100001111), .Y(inst165_y));
  CONSTX #(.size(10), .\const (600)) inst71 (.data(inst71_data));
  RisingEdge inst222 (.IN(inst70_eq), .CLK(CLK), .OUT(end2));
  and inst77 (valid2, xok2, yok2);
  MP2X #(.size(10)) inst251 (.S(inst252_gr), .X0({\rand [4:0], 5'b01111}), .X1(10'b1100001111), .Y(inst251_y));
  CMPX #(.size(10)) inst168 (.A(inst180_data_out), .B(inst169_data), .eq(inst168_eq));  // open: ls, gr
  CONSTX #(.size(10), .\const (600)) inst169 (.data(inst169_data));
  RisingEdge inst230 (.IN(inst168_eq), .CLK(CLK), .OUT(end6));
  and inst176 (valid6, xok6, yok6);
  CMPX #(.size(10)) inst189 (.A({\rand [4:0], {5{1'b0}}}), .B(inst205_data), .gr(inst189_gr));  // open: ls, eq
  or inst111 (inst111_out, catch3, end3, reset);
  CMPX #(.size(10)) inst95 (.A(X), .B(inst91_data_out), .gr(inst95_gr));  // open: ls, eq
  CMPX #(.size(10)) inst121 (.A(Y), .B(inst102_data_out), .gr(inst121_gr));  // open: ls, eq
  CMPX #(.size(10)) inst255 (.A({\rand [4:0], {5{1'b0}}}), .B(inst256_data), .gr(inst255_gr));  // open: ls, eq
  CONSTX #(.size(10), .\const (769)) inst205 (.data(inst205_data));
  REGX #(.size(10), .default_value(1004)) inst102 (
    .clk(CLK), .ld(start3), .cl(inst111_out), .inc(incY3), .data_in(inst101_data), .data_out(inst102_data_out));  // open: dec
  or inst211 (inst211_out, catch7, end7, reset);
  CMPX #(.size(10)) inst194 (.A(X), .B(inst190_data_out), .gr(inst194_gr));  // open: ls, eq
  CMPX #(.size(10)) inst199 (.A(Y), .B(inst202_data_out), .gr(inst199_gr));  // open: ls, eq
  REGX #(.size(10), .default_value(0)) inst91 (
    .clk(CLK), .ld(start3), .data_in(inst185_y), .data_out(inst91_data_out));  // open: cl, inc, dec
  CONSTX #(.size(10), .\const (769)) inst256 (.data(inst256_data));
  REGX #(.size(10), .default_value(0)) inst190 (
    .clk(CLK), .ld(start7), .data_in(inst254_y), .data_out(inst190_data_out));  // open: cl, inc, dec
  REGX #(.size(10), .default_value(1004)) inst202 (
    .clk(CLK), .ld(start7), .cl(inst211_out), .inc(incY7), .data_in(inst201_data), .data_out(inst202_data_out));  // open: dec
  or inst238 (inst238_out, catch7, end7, reset);
  CONSTX #(.size(10), .\const (1004)) inst101 (.data(inst101_data));
  or inst234 (inst234_out, catch3, end3, reset);
  MP2X #(.size(10)) inst185 (.S(inst189_gr), .X0({\rand [4:0], {5{1'b0}}}), .X1(10'b1100000000), .Y(inst185_y));
  CONSTX #(.size(10), .\const (1004)) inst201 (.data(inst201_data));
  MP2X #(.size(10)) inst254 (.S(inst255_gr), .X0({\rand [4:0], {5{1'b0}}}), .X1(10'b1100000000), .Y(inst254_y));
  SRFF inst84 (.S(start7), .R(inst238_out), .CLK(CLK), .Q(can_incY7));  // open: PRN, CLRN
  SRFF inst61 (.S(start3), .R(inst234_out), .CLK(CLK), .Q(can_incY3));  // open: PRN, CLRN
  CMPX #(.size(10)) inst207 (.A({\rand [4:0], 5'b01111}), .B(inst208_data), .gr(inst207_gr));  // open: ls, eq
  or inst112 (inst112_out, catch3, end3, reset);
  CMPX #(.size(10)) inst105 (.A(inst104_data_out), .B(inst106_data), .eq(inst105_eq));  // open: ls, gr
  CMPX #(.size(10)) inst96 (.A(X), .B(inst92_data_out), .ls(inst96_ls));  // open: eq, gr
  CMPX #(.size(10)) inst98 (.A(Y), .B(inst104_data_out), .ls(inst98_ls));  // open: eq, gr
  or inst212 (inst212_out, catch7, end7, reset);
  CONSTX #(.size(10), .\const (786)) inst208 (.data(inst208_data));
  CONSTX #(.size(10), .\const (300)) inst106 (.data(inst106_data));
  RisingEdge inst223 (.IN(inst105_eq), .CLK(CLK), .OUT(start4));
  and inst110 (incY3, can_incY3, incY);
  CMPX #(.size(10)) inst258 (.A({\rand [4:0], 5'b01111}), .B(inst259_data), .gr(inst258_gr));  // open: ls, eq
  CMPX #(.size(10)) inst195 (.A(X), .B(inst191_data_out), .ls(inst195_ls));  // open: eq, gr
  CMPX #(.size(10)) inst197 (.A(Y), .B(inst204_data_out), .ls(inst197_ls));  // open: eq, gr
  REGX #(.size(10), .default_value(0)) inst92 (
    .clk(CLK), .ld(start3), .data_in(inst206_y), .data_out(inst92_data_out));  // open: cl, inc, dec
  REGX #(.size(10), .default_value(0)) inst104 (
    .clk(CLK), .ld(start3), .cl(inst112_out), .inc(incY3), .data_in(inst103_data), .data_out(inst104_data_out));  // open: dec
  CONSTX #(.size(10), .\const (786)) inst259 (.data(inst259_data));
  and inst210 (incY7, can_incY7, incY);
  CONSTX #(.size(10), .\const (0)) inst103 (.data(inst103_data));
  and inst97 (xok3, inst96_ls, inst95_gr);
  and inst99 (yok3, inst98_ls, inst121_gr);
  REGX #(.size(10), .default_value(0)) inst191 (
    .clk(CLK), .ld(start7), .data_in(inst257_y), .data_out(inst191_data_out));  // open: cl, inc, dec
  REGX #(.size(10), .default_value(0)) inst204 (
    .clk(CLK), .ld(start7), .cl(inst212_out), .inc(incY7), .data_in(inst203_data), .data_out(inst204_data_out));  // open: dec
  MP2X #(.size(10)) inst206 (.S(inst207_gr), .X0({\rand [4:0], 5'b01111}), .X1(10'b1100001111), .Y(inst206_y));
  CMPX #(.size(10)) inst93 (.A(inst104_data_out), .B(inst94_data), .eq(inst93_eq));  // open: ls, gr
  CONSTX #(.size(10), .\const (0)) inst203 (.data(inst203_data));
  and inst196 (xok7, inst195_ls, inst194_gr);
  and inst198 (yok7, inst197_ls, inst199_gr);
  CONSTX #(.size(10), .\const (600)) inst94 (.data(inst94_data));
  RisingEdge inst224 (.IN(inst93_eq), .CLK(CLK), .OUT(end3));
  and inst100 (valid3, xok3, yok3);
  MP2X #(.size(10)) inst257 (.S(inst258_gr), .X0({\rand [4:0], 5'b01111}), .X1(10'b1100001111), .Y(inst257_y));
  CMPX #(.size(10)) inst192 (.A(inst204_data_out), .B(inst193_data), .eq(inst192_eq));  // open: ls, gr
  CONSTX #(.size(10), .\const (600)) inst193 (.data(inst193_data));
  RisingEdge inst231 (.IN(inst192_eq), .CLK(CLK), .OUT(end7));
  and inst200 (valid7, xok7, yok7);

  // Other names for the same wires on the sheet: start0 = start
endmodule
